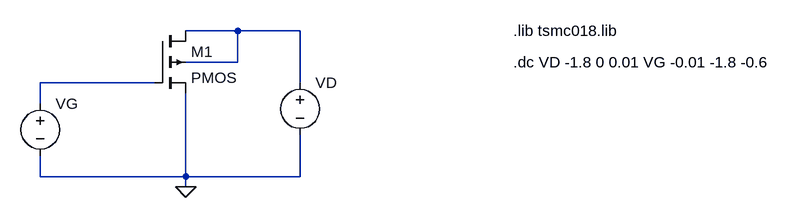
[diagram p0: schematic 180p_IDVD.asc]
180p_IDVD.asc, the LTspice schematic file:
Version 4
SHEET 1 1168 680
WIRE 320 128 240 128
WIRE 416 128 320 128
WIRE 320 176 320 128
WIRE 320 176 240 176
WIRE 192 208 16 208
WIRE 416 208 416 128
WIRE 16 240 16 208
WIRE 16 352 16 320
WIRE 240 352 240 224
WIRE 240 352 16 352
WIRE 416 352 416 288
WIRE 416 352 240 352
WIRE 240 368 240 352
FLAG 240 368 0
SYMBOL pmos4 192 128 R0
SYMATTR InstName M1
SYMATTR Value2 l=180n w=270n
SYMBOL voltage 16 224 R0
WINDOW 123 0 0 Left 0
WINDOW 39 0 0 Left 0
SYMATTR InstName VG
SYMATTR Value ""
SYMBOL voltage 416 192 R0
WINDOW 123 0 0 Left 0
WINDOW 39 0 0 Left 0
SYMATTR InstName VD
SYMATTR Value ""
TEXT 744 128 Left 2 !.lib tsmc018.lib
TEXT 744 176 Left 2 !.dc VD -1.8 0 0.01 VG -0.01 -1.8 -0.6

The netlist it stands for:
* 180p_IDVD.asc
M1 N001 N002 0 N001 PMOS l=180n w=270n
VG N002 0
VD N001 0
.model NMOS NMOS
.model PMOS PMOS
.lib standard.mos
.lib tsmc018.lib
.dc VD -1.8 0 0.01 VG -0.01 -1.8 -0.6
.backanno
.end